# EAGLE board ccnor_stm32_v24-sync (EAGLE 6.1), part 1 of 2
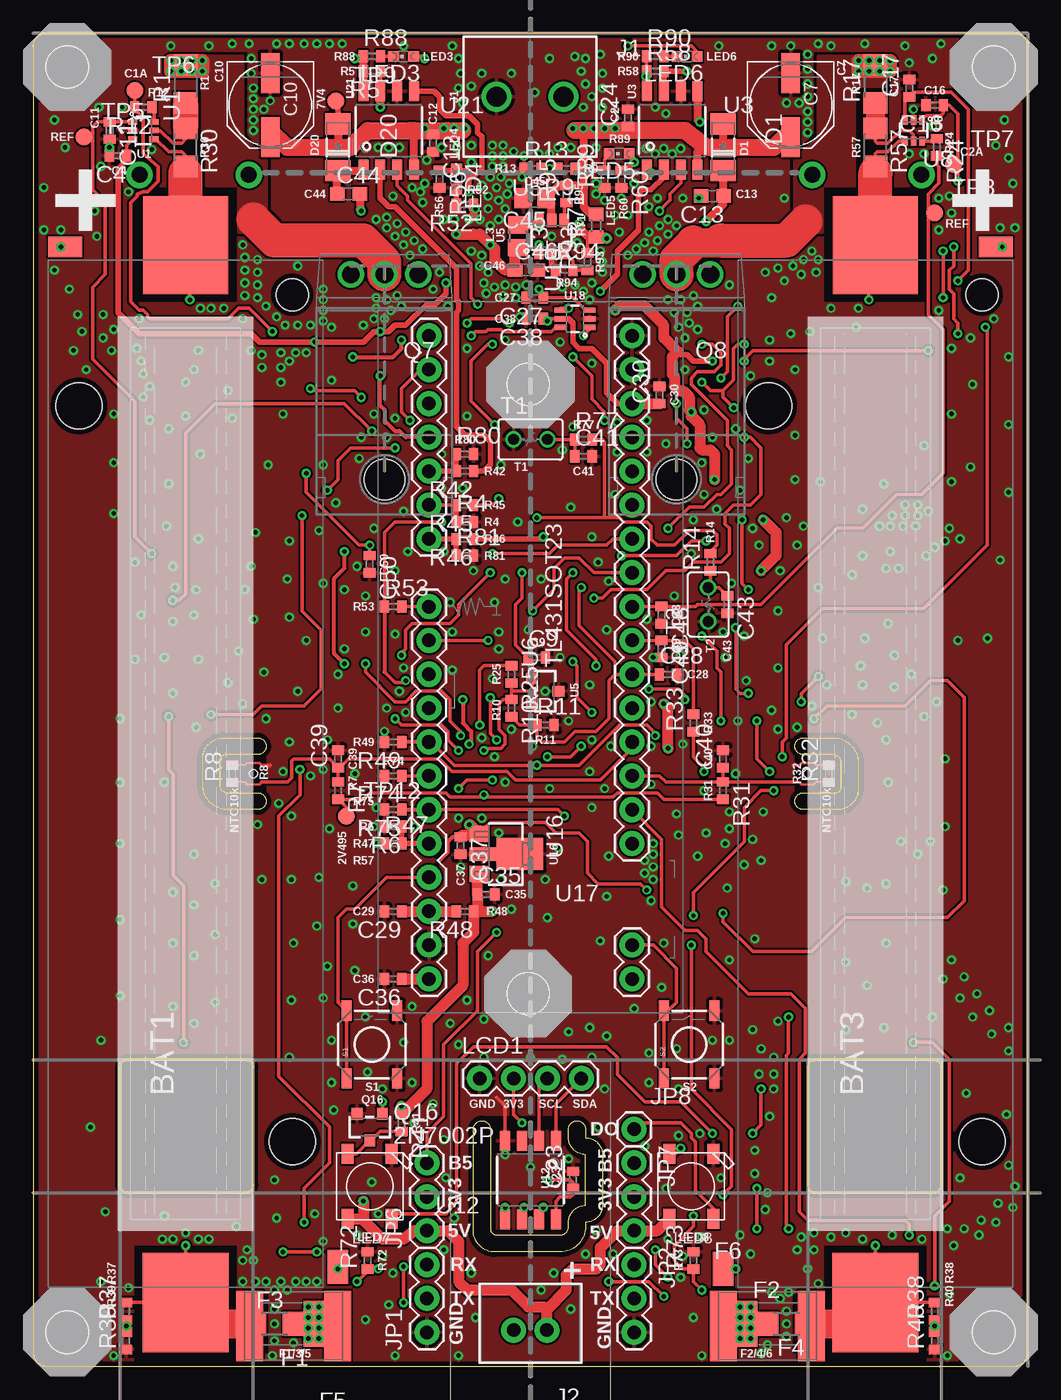
[diagram p2: board, top side]
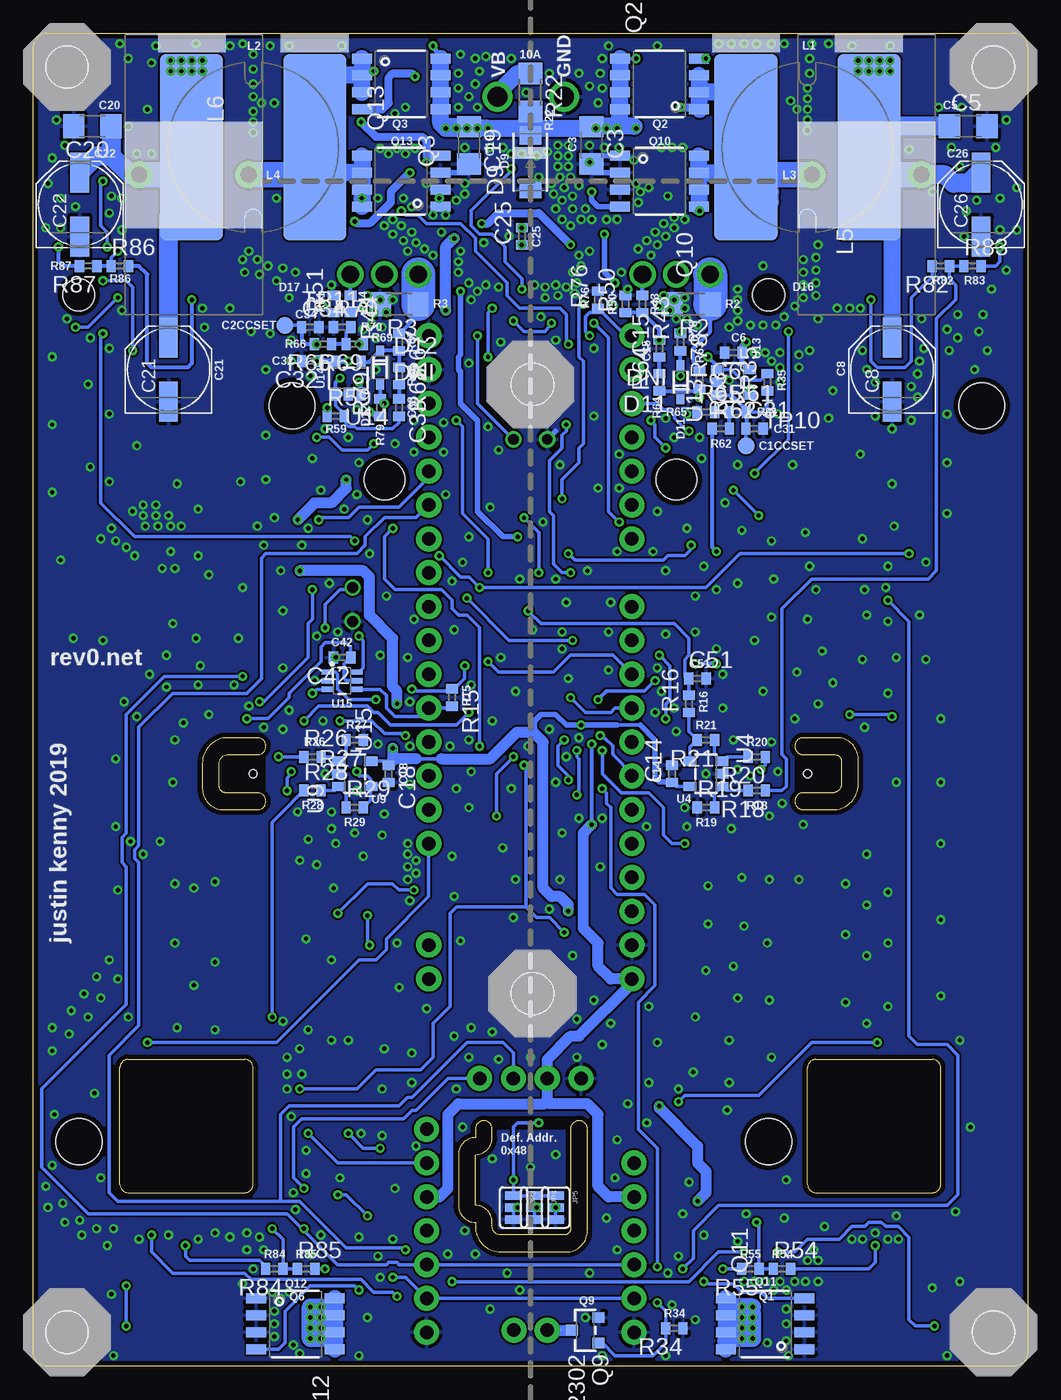
[diagram p3: board, bottom side, seen from below]

Size 74.6 x 100 mm. Coordinates in mm from the lower left corner, seen from the top.
Outline: 1,0 73.6,0 arc90 74.6,1 74.6,99 arc90 73.6,100 1,100 arc90 0,99 0,1 arc90 1,0
Outline: 34.29,17.78 34.29,10.32 arc90 34.77,9.84 39.53,9.84 arc90 40.16,10.48 40.16,10.79 arc-90 41.43,12.06 41.43,15.88 arc-90 40.16,17.14 40.16,17.78 arc-180 41.43,17.78 41.43,17.14 arc-90 42.7,15.88 42.7,12.06 arc-90 41.43,10.79 41.43,10.48 arc-90 39.53,8.57 34.61,8.57 arc-90 33.02,10.16 33.02,17.78 arc-180 34.29,17.78
Outline: 57.78,43.02 60.17,43.02 arc90 60.64,43.5 60.64,45.24 arc90 60.01,45.88 57.78,45.88 arc-180 57.78,47.15 60.01,47.15 arc-90 61.91,45.24 61.91,43.34 arc-90 60.33,41.75 57.78,41.75 arc-180 57.78,43.02
Outline: 16.83,45.88 14.45,45.88 arc90 13.97,45.4 13.97,43.66 arc90 14.61,43.02 16.83,43.02 arc-180 16.83,41.75 14.61,41.75 arc-90 12.7,43.66 12.7,45.56 arc-90 14.29,47.15 16.83,47.15 arc-180 16.83,45.88
Outline: 6.51,13.65 6.51,22.38 arc-90 7.14,23.02 15.88,23.02 arc-90 16.51,22.38 16.51,13.65 arc-90 15.88,13.02 7.14,13.02 arc-90 6.51,13.65
Outline: 58.1,13.65 58.1,22.38 arc-90 58.74,23.02 67.47,23.02 arc-90 68.1,22.38 68.1,13.65 arc-90 67.47,13.02 58.74,13.02 arc-90 58.1,13.65
Copper layers (1*16): Top 0.0356mm / dielectric 1.5011mm / Bottom 0.0356mm
Design rules: minimum track width 6mil, minimum drill 13mil, track to track 6mil, track to pad 6mil, pad to pad 6mil, via to via 6mil, smd to smd 6mil, copper to edge 15mil, drill to drill 6mil, minimum pad ring 7mil, minimum via ring 7mil, stop-mask expansion 2.5mil, vias tented up to drill 14mil, thermal gap 10mil
Holes 3.17 mm at 2.54,2.54 72.07,2.54 72.07,97.47 37.15,73.66 37.15,27.94 2.54,97.47
Holes 3.05 mm at 26.35,66.52 48.26,66.52
Holes 0.6 mm at 16.51,44.45 58.1,44.45
tRestrict: area 34,17.8 to 40.5,18.7; area -0.6,94.3 to 5.7,100.6; area 68.9,94.3 to 75.2,100.6; area -0.6,-0.6 to 5.7,5.7; area 68.9,-0.6 to 75.2,5.7; area 34,24.8 to 40.3,31.1; area 34.1,70.5 to 40.5,76.8; area 57.1,42.5 to 59.1,46.4; area 14,43 to 17.5,45.7; area 59.4,0.5 to 67,9; area 57,1 to 59.4,5.4; area 7.6,0.5 to 15.2,9; area 15.2,1 to 17.6,5.4; area 7.6,79.9 to 15.2,88.4; area 59.4,79.9 to 67,88.4
bRestrict: area 34,17.8 to 40.5,18.7; area 57.1,42.5 to 61,46.4; area 14,42.5 to 17.5,46.4; area -0.6,-0.6 to 5.7,5.7; area 68.9,-0.6 to 75.2,5.7; area 68.9,94.3 to 75.2,100.6; area -0.6,94.3 to 5.7,100.6; area 34.1,70.5 to 40.5,76.8; area 34,24.8 to 40.3,31.1

## Footprints (pad centres in the part's own frame; a part is rotated, then mirrored left to right if it is on the bottom)
1S_18650_SMD_NH = smd 7.341 x 6.35: 1+ 39.67,0 | smd 7.46 x 6.47: 1- -39.67,0 | hole 3.454: -27.6,-8; 27.6,8 | hole 2.39: 35.93,-8
C1206 = smd 1.6 x 1.8: 1 -1.4,0; 2 1.4,0
C0402 = smd 0.7 x 0.9: 1 -0.65,0; 2 0.65,0
PANASONIC_D = smd 3 x 1.4: + 2.4,0; - -2.4,0
C0603 = smd 1.1 x 1: 1 -0.85,0; 2 0.85,0
C0805 = smd 1.3 x 1.5: 1 -0.85,0; 2 0.85,0
SOD123 = smd 1.6 x 1.9: A -1.75,0; K 1.75,0
SMA = smd 1.4 x 1.64: A -2.015,0; K 2.015,0
SOD323 = smd 0.6 x 0.8: A 0,-1.25; K 0,1.25
1812 = smd 1.9 x 3.45: 1 -2.5,0; 2 2.5,0
R1206 = smd 1.6 x 1.803: 1 -1.422,0; 2 1.422,0
2920 = smd 2 x 5.3: A -3.3,0; K 3.3,0
PHOENIXCONTACT1935161 = drill 1.5: 1 0,0; 2 5,0
B2B-XH-A = drill 1.016 pad 1.88: 1 -2.5,0; 2 0,0
1X03 = drill 1.016 pad 1.88: 1 0,0; 2 2.54,0; 3 5.08,0
SJ_3 = smd 0.635 x 1.27: 1 -0.889,0; 2 0,0; 3 0.889,0
1X01 = drill 1.016 pad 1.88: 1 0,0
INDUCTOR_SMD_13MM = smd 14 x 4.75: 1 0,4.625; 2 0,-4.625
0805 = smd 1.3 x 1.5: 1 -0.85,0; 2 0.85,0
INDUCTOR_10A_8.2MMX21MM = drill 1.2 pad 2: P$1 0,4.1; P$2 0,-4.1
OLED0.91 = drill 1.016 pad 1.88: 1=GND -3.81,0; 2-VCC -1.27,0; 3=SCL 1.27,0; 4-SDA 3.81,0
CHIPLED_0603 = smd 0.8 x 0.8: A 0,-0.75; C 0,0.75
WS2812B = smd 1.5 x 0.9: 1-VDD 2.45,-1.65; 2-DOUT 2.45,1.65; 3-GND -2.45,1.65; 4-DIN -2.45,-1.65
8-SOIC = smd 0.75 x 1.5: 1 -1.905,-2.95; 2 -0.635,-2.95; 3 0.635,-2.95; 4 1.905,-2.95; 5 1.905,2.95; 6 0.635,2.95; 7 -0.635,2.95; 8 -1.905,2.95
TO-220 = drill 1.325: 1 -2.54,0; 2 0,0; 3 2.54,0
SOT23 = smd 0.8 x 0.9: 1 0.95,1; 2 -0.95,1; 3 0,-1
R0402 = smd 0.7 x 0.9: 1 -0.65,0; 2 0.65,0
R0603 = smd 1 x 1.1: 1 -0.85,0; 2 0.85,0
TACTILE_SWITCH_SMD = smd 1.524 x 0.762: 1 -2.54,1.905; 2 2.54,1.905; 3 -2.54,-1.905; 4 2.54,-1.905
THERMISTOR_3MMX3MM = drill 0.813: 1 -1.27,0; 2 1.27,0
TPAD_LONG = smd 2.54 x 1.524: P$1 0,0
TPAD_MED_ROUND = smd 1.27 x 1.27: 1 0,0
SOT-363 = smd 0.42 x 0.7: 1 -0.65,-0.8; 2 0,-0.8; 3 0.65,-0.8; 4 0.65,0.8; 5 0,0.8; 6 -0.65,0.8
SOT23-5 = smd 0.7 x 1: 1 0.95,1.2; 2 0,1.2; 3 -0.95,1.2; 4 -0.95,-1.2; 5 0.95,-1.2
SOT23-6 = smd 0.7 x 1: 1 -0.95,-1.2; 2 0,-1.2; 3 0.95,-1.2; 4 0.95,1.2; 5 0,1.2; 6 -0.95,1.2
SC70-6 = smd 0.4 x 0.9: 1 -0.65,-1.1; 2 0,-1.1; 3 0.65,-1.1; 4 0.65,1.1; 5 0,1.1; 6 -0.65,1.1
SOT-89 = smd 1.2 x 1.5: 1 -1.5,0; 3 1.5,0 | smd 1 x 2: 2 0,0.25 | smd 2.4 x 3.5: 2@1 0,3
STM32_BLUE_PILL_USABLE = drill 1.016 pad 1.88: 3V3 -7.62,-19.05; 3V3_2 7.62,24.13; 5V 7.62,19.05; A0 -7.62,13.97; A1 -7.62,11.43; A2 -7.62,8.89; A3 -7.62,6.35; A4 -7.62,3.81; A5 -7.62,1.27; A6 -7.62,-1.27; A7 -7.62,-3.81; A8 7.62,-13.97; A9 7.62,-11.43; A10 7.62,-8.89; A12 7.62,-3.81; A15 7.62,-1.27; B0 -7.62,-6.35; B1 -7.62,-8.89; B3 7.62,1.27; B4 7.62,3.81; B5 7.62,6.35; B6 7.62,8.89; B7 7.62,11.43; B8 7.62,13.97; B9 7.62,16.51; B10 -7.62,-11.43; B11 -7.62,-13.97; B12 7.62,-24.13; B13 7.62,-21.59; B14 7.62,-19.05; B15 7.62,-16.51; C13 -7.62,21.59; GND -7.62,-24.13; GND2 -7.62,-21.59; GND4 7.62,21.59; RST -7.62,-16.51; VBAT -7.62,24.13

## Placement (x,y rotation side)
BAT1  1_18650_HOLDER  [1S_18650_SMD_NH]  11.43,44.45 90 top
BAT3  1_18650_HOLDER  [1S_18650_SMD_NH]  63.18,44.45 90 top
C3  10u  [C1206]  32.7,91.6 270 bottom
C4  1u  [C0402]  6.35,90.81 180 top
C5  10u  [C1206]  4.45,93.03 0 bottom
C6  DNI  [C0402]  22.07,76.04 180 bottom
C7  220u  [PANASONIC_D]  56.83,94.61 270 top
C8  220u  [PANASONIC_D]  10.16,74.77 90 bottom
C9  1u  [C0402]  37.78,53.18 0 top
C10  220u  [PANASONIC_D]  17.78,94.61 270 top
C11  1u  [C0402]  5.71,92.71 270 top
C12  1u  [C0402]  30,91.76 270 top
C13  1u  [C0603]  50.96,87.79 180 top
C14  1u  [C0402]  26.67,44.45 90 bottom
C15  DNI  [C0402]  27.62,76.36 90 bottom
C16  1u  [C0402]  67.63,94.61 180 top
C17  1u  [C0402]  65.72,95.89 90 top
C18  1u  [C0402]  47.94,44.45 270 bottom
C19  10u  [C1206]  41.91,91.6 270 bottom
C20  10u  [C1206]  70.17,93.03 180 bottom
C21  220u  [PANASONIC_D]  64.45,74.77 90 bottom
C22  220u  [PANASONIC_D]  71.12,87.15 90 bottom
C23  DNI  [C0402]  40.48,13.97 90 top
C24  1u  [C0402]  44.61,93.66 90 top
C25  100n  [C0402]  37.94,84.77 90 bottom
C26  220u  [PANASONIC_D]  3.49,87.15 90 bottom
C27  1u  [C0402]  37.62,80.17 180 top
C28  4.7u  [C0402]  47.62,51.91 0 top
C29  1u  [C0402]  26.99,34.13 180 top
C30  1u  [C0402]  46.99,72.87 90 top
C31  100n  [C0402]  20.48,70.33 0 bottom
C32  DNI  [C0402]  53.82,75.41 180 bottom
C33  DNI  [C0402]  47.15,71.91 270 bottom
C34  100n  [C0402]  53.82,77.95 0 bottom
C35  1u  [C0402]  33.97,35.4 0 top
C36  1u  [C0402]  26.99,29.05 180 top
C37  1u  [C0402]  32.07,39.05 270 top
C38  1u  [C0402]  37.62,78.58 180 top
C39  1u  [C0402]  22.86,45.56 90 top
C40  1u  [C0402]  51.75,45.56 90 top
C41  1u  [C0402]  41.27,68.26 0 top
C42  DNI  [C0402]  51.44,53.18 180 bottom
C43  DNI  [C0402]  52.07,57.15 270 top
C44  1u  [C0603]  23.65,87.95 0 top
C45  22u  [C0805]  37.62,87.63 180 top
C46  22u  [C0603]  36.99,82.23 0 top
C48  100n  [C0402]  47.15,56.36 270 top
C49  100n  [C0402]  47.15,53.82 270 top
C50  100n  [C0402]  25.24,60.17 270 top
C51  100n  [C0402]  24.77,51.59 0 bottom
D1  SS16F  [SOD123]  51.75,91.44 270 top
D9  SS54  [SMA]  37.31,90.33 90 bottom
D11  DNI  [SOD323]  26.04,73.82 180 bottom
D12  DNI  [SOD323]  48.58,74.93 0 bottom
D20  SS16F  [SOD123]  22.86,91.44 270 top
F1  DNI  [1812]  18.73,3.17 180 top
F2  DNI  [1812]  55.88,3.17 0 top
F3  3.5A  [R1206]  18.1,3.17 0 top
F4  3.5A  [R1206]  56.52,3.17 180 top
F5  PTC2920  [2920]  19.53,3.02 180 top
F6  PTC2920  [2920]  55.09,3.02 0 top
J1  M02PT  [PHOENIXCONTACT1935161]  34.77,95.25 0 top
J2  M02  [B2B-XH-A]  36.04,2.7 180 top
JP1  [1X03]  29.53,2.54 90 top
JP2  [1X03]  45.09,7.62 270 top
JP3  JUMPER-3SMD  [SJ_3]  38.58,11.91 270 bottom
JP4  JUMPER-3SMD  [SJ_3]  36.99,11.91 270 bottom
JP5  JUMPER-3SMD  [SJ_3]  35.4,11.91 270 bottom
JP6  [1X03]  29.53,10.16 90 top
JP7  [1X03]  45.09,15.24 270 top
JP8  M01PTH  [1X01]  45.09,17.78 0 top
L1  DNI  [INDUCTOR_SMD_13MM]  16.51,91.44 90 bottom
L2  DNI  [INDUCTOR_SMD_13MM]  58.1,91.44 270 bottom
L3  4.7u  [0805]  36.35,84.77 270 top
L5  60u  [INDUCTOR_10A_8.2MMX21MM]  12.06,89.38 90 bottom
L6  60u  [INDUCTOR_10A_8.2MMX21MM]  62.55,89.38 270 bottom
LCD1  OLED0.91  [OLED0.91]  37.31,21.59 0 top
LED3  DNI  [CHIPLED_0603]  27.78,98.27 90 top
LED4  DNI  [CHIPLED_0603]  31.75,89.06 180 top
LED5  DNI  [CHIPLED_0603]  43.97,90.96 90 top
LED6  DNI  [CHIPLED_0603]  49.05,98.27 90 top
LED7  WS2812B  [WS2812B]  25.24,13.49 270 top
LED8  WS2812B  [WS2812B]  49.37,13.49 270 top
Q2  WSP4406  [8-SOIC]  27.62,96.2 90 bottom
Q3  WSP4406  [8-SOIC]  46.99,96.2 270 bottom
Q7  IRLB8314PBF  [TO-220]  26.35,81.92 180 top
Q8  IRLB8314PBF  [TO-220]  48.26,81.92 180 top
Q9  2302  [SOT23]  33.18,2.7 270 bottom
Q10  WSP4406  [8-SOIC]  27.62,88.9 270 bottom
Q11  NCE3018AS  [8-SOIC]  19.68,3.17 90 bottom
Q12  NCE3018AS  [8-SOIC]  54.93,3.17 270 bottom
Q13  WSP4406  [8-SOIC]  46.99,88.9 90 bottom
Q16  2N7002P  [SOT23]  25.24,17.94 0 top
R1  0  [R1206]  11.43,96.2 90 top
R2  0  [R1206]  25.24,79.69 180 bottom
R3  0  [R1206]  47.15,79.69 180 bottom
R4  10k  [R0402]  32.38,63.34 0 top
R5  10k  [R0402]  25.4,97.16 180 top
R6  10k  [R0402]  26.99,40.48 180 top
R7  10k  [R0402]  22.86,43.18 270 top
R8  NTC 10k  [R0402]  14.92,44.45 90 top
R9  30k  [R0402]  40.01,89.85 180 top
R10  820  [R0402]  35.88,49.37 270 top
R11  1.6k  [R0402]  38.42,48.1 0 top
R12  1.6k  [R0402]  8.26,94.46 180 top
R13  10k  [R0402]  37.47,89.85 0 top
R14  DNI  [R0402]  50.8,60.33 90 top
R15  0  [R0402]  43.18,50.16 270 bottom
R16  1.6k  [R0402]  25.4,49.69 90 bottom
R17  0  [R1206]  63.18,96.2 90 top
R18  220k  [R0402]  20.32,43.18 180 bottom
R19  150k  [R0402]  24.13,41.91 0 bottom
R20  220k  [R0402]  20.32,45.72 180 bottom
R21  150k  [R0402]  24.13,46.99 180 bottom
R22  5A  [R1206]  37.31,95.57 270 bottom
R24  1.6k  [R0402]  67.79,91.44 270 top
R25  120  [R0402]  35.88,51.91 270 top
R26  220k  [R0402]  53.66,45.72 0 bottom
R27  150k  [R0402]  50.48,46.99 180 bottom
R28  220k  [R0402]  53.66,43.18 0 bottom
R29  150k  [R0402]  50.48,41.91 0 bottom
R30  5m  [R1206]  11.43,91.44 270 top
R31  10k  [R0402]  51.75,43.18 270 top
R32  NTC 10k  [R0402]  59.69,44.45 90 top
R33  1.6k  [R0402]  49.53,48.26 90 top
R34  10k  [R0402]  26.51,2.86 180 bottom
R35  0  [R0402]  19.53,73.82 90 bottom
R37  10k  [R0402]  6.99,4.13 90 top
R38  10k  [R0402]  67.63,4.13 90 top
R39  10k  [R0402]  6.99,1.91 90 top
R40  10k  [R0402]  67.63,1.91 90 top
R41  680  [R0402]  27.62,18.26 270 top
R42  0  [R0402]  32.38,67.15 180 top
R43  0  [R0402]  28.89,79.69 270 bottom
R44  0  [R0402]  50.8,79.69 270 bottom
R45  0  [R0402]  32.38,64.61 180 top
R46  0  [R0402]  32.38,62.07 180 top
R47  0  [R0402]  26.99,39.21 0 top
R48  10  [R0402]  32.38,34.13 180 top
R49  10k  [R0402]  26.99,46.83 180 top
R50  DNI  [R0402]  30.16,79.69 90 bottom
R51  DNI  [R0402]  52.07,79.69 90 bottom
R52  DNI  [R0402]  32.38,87.15 180 top
R53  1.6k  [R0402]  26.99,56.99 0 top
R54  0  [R0402]  18.41,7.3 0 bottom
R55  DNI  [R0402]  20.8,7.3 180 bottom
R56  10k  [R0402]  30.48,89.06 270 top
R57  5m  [R1206]  63.18,91.44 270 top
R58  10k  [R0402]  46.67,97.16 0 top
R59  0  [R0402]  51.91,71.28 0 bottom
R60  10k  [R0402]  44.13,89.06 270 top
R61  10k  [R0402]  21.75,71.6 0 bottom
R62  0  [R0402]  23.02,70.33 0 bottom
R63  DNI  [R0402]  24.61,73.98 270 bottom
R64  DNI  [R0402]  27.62,73.82 90 bottom
R65  DNI  [R0402]  24.13,71.6 0 bottom
R66  10k  [R0402]  52.86,76.68 180 bottom
R67  DNI  [R0402]  47.15,76.83 270 bottom
R68  DNI  [R0402]  47.15,74.3 270 bottom
R69  0  [R0402]  50.48,76.68 180 bottom
R70  DNI  [R0402]  51.44,77.95 0 bottom
R71  0  [R0603]  42.23,85.57 90 top
R72  10k  [R0402]  25.08,7.94 90 top
R73  10k  [R0402]  49.53,7.94 90 top
R74  10k  [R0402]  26.99,44.29 180 top
R75  10k  [R0402]  26.99,41.75 180 top
R76  10k  [R0402]  32.23,80.01 90 bottom
R77  10k  [R0402]  41.27,69.53 0 top
R78  DNI  [R0402]  26.04,76.83 270 bottom
R79  DNI  [R0402]  48.58,71.91 90 bottom
R80  10k  [R0402]  32.38,68.42 0 top
R81  10k  [R0402]  32.38,60.8 0 top
R82  DNI  [R0402]  6.51,82.55 180 bottom
R83  0  [R0402]  4.13,82.55 0 bottom
R84  0  [R0402]  56.52,7.3 180 bottom
R85  DNI  [R0402]  54.13,7.3 0 bottom
R86  DNI  [R0402]  68.1,82.55 0 bottom
R87  0  [R0402]  70.48,82.55 180 bottom
R88  DNI  [R0402]  25.4,98.27 0 top
R89  DNI  [R0402]  42.86,89.06 90 top
R90  DNI  [R0402]  46.67,98.27 0 top
R93  [R0402]  41.59,82.87 90 top
R94  [R0402]  39.85,82.23 0 top
R95  100k  [R0402]  40.01,87.95 90 top
S1  [TACTILE_SWITCH_SMD]  25.4,24.13 90 top
S2  [TACTILE_SWITCH_SMD]  49.21,24.13 90 top
T1  NTC3MM  [THERMISTOR_3MMX3MM]  37.31,69.53 0 top
T2  DNI  [THERMISTOR_3MMX3MM]  50.64,57.15 90 top
TP1  TPADLONG  [TPAD_LONG]  22.86,7.46 90 top
TP2  TPADLONG  [TPAD_LONG]  2.38,83.98 0 top
TP3  TPADLONG  [TPAD_LONG]  51.75,7.3 90 top
TP4  TPADLONG  [TPAD_LONG]  72.23,83.98 0 top
TP5  TPADMED_ROUND  [TPAD_MED_ROUND]  3.81,92.23 0 top
TP6  TPADMED_ROUND  [TPAD_MED_ROUND]  7.62,95.73 0 top
TP7  TPADMED_ROUND  [TPAD_MED_ROUND]  69.06,90.17 0 top
TP8  TPADMED_ROUND  [TPAD_MED_ROUND]  67.63,86.52 0 top
TP9  TPADMED_ROUND  [TPAD_MED_ROUND]  22.7,94.93 0 top
TP10  TPADMED_ROUND  [TPAD_MED_ROUND]  21.11,69.06 0 bottom
TP11  TPADMED_ROUND  [TPAD_MED_ROUND]  55.72,78.11 0 bottom
TP12  TPADMED_ROUND  [TPAD_MED_ROUND]  23.5,41.27 0 top
U1  NCS199A1  [SOT-363]  8.26,92.71 270 top
U3  ADP3110A  [8-SOIC]  47.94,92.71 0 top
U4  MCP6001U  [SOT23-5]  24.13,44.45 270 bottom
U5  JW5052C  [SOT23-6]  38.89,84.77 0 top
U6  TL431SOT23  [SOT23]  38.42,50.64 90 top
U8  NCS199A1  [SOT-363]  66.04,92.71 180 top
U9  MCP6001U  [SOT23-5]  50.48,44.45 90 bottom
U12  LM75A  [8-SOIC]  37.31,13.97 180 top
U13  DNI  [SOT23-5]  22.07,73.82 90 bottom
U14  DNI  [SOT23-5]  50.96,74.14 180 bottom
U15  DNI  [SC70-6]  51.44,51.44 270 bottom
U16  3.3V  [SOT-89]  33.5,38.42 270 top
U17  STM32_BLUE_PILL  [STM32_BLUE_PILL_USABLE]  37.31,53.18 180 top
U18  SN74LVC1G3157SC70-6  [SC70-6]  40.64,78.58 90 top
U21  ADP3110A  [8-SOIC]  26.67,92.71 0 top